# Altium schematic sheet Transceivers.SchDoc: Payload Card Transceivers
size A3; Revision: 1A; SheetNumber: 2; SheetTotal: 6; Organization: Brickworks; Address1: Matthew Glazer; Address2: Design Engineer
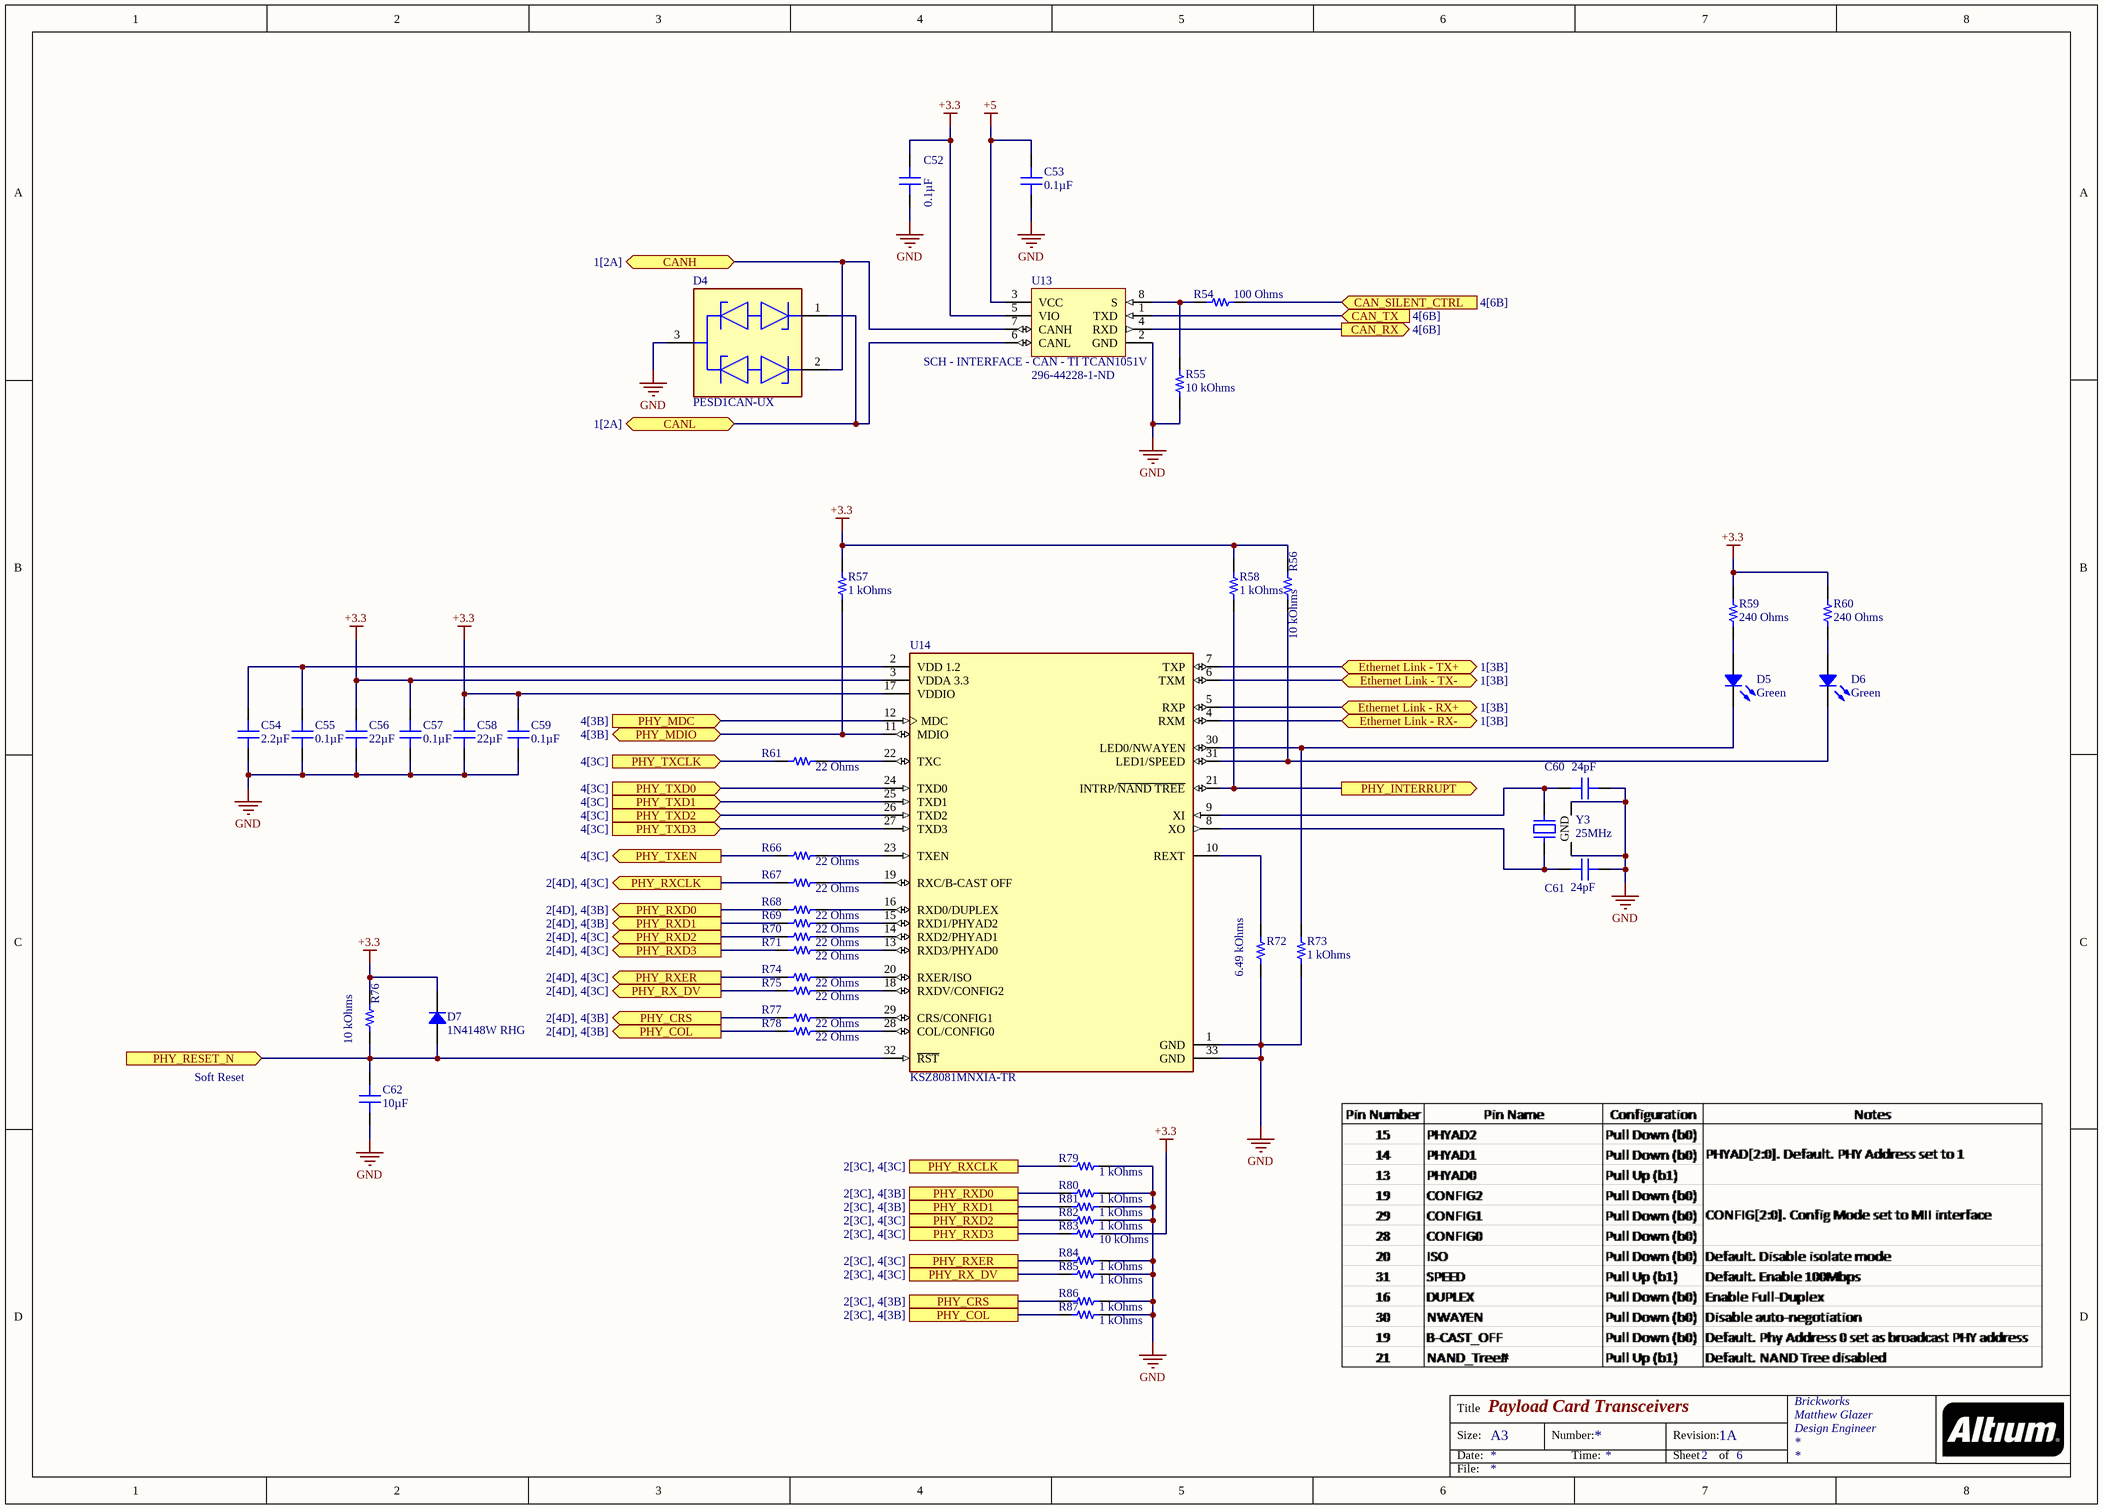
[diagram p0: Transceivers.SchDoc]

## Parts
C52  0.1µF  [CAP 0603_1608]
C53  0.1µF  [CAP 0603_1608]
C54  2.2µF  [CAP 0805_2012]
C55  0.1µF  [CAP 0603_1608]
C56  22µF  [CAP 0805_2012]
C57  0.1µF  [CAP 0603_1608]
C58  22µF  [CAP 0805_2012]
C59  0.1µF  [CAP 0603_1608]
C60  24pF  [CAP 0603_1608]
C61  24pF  [CAP 0603_1608]
C62  10µF  [CAP 0805_2012]
D4  PESD1CAN-UX  [FP-SOT323-MFG]
D5  Green  [LED 0603_1608 GREEN]
D6  Green  [LED 0603_1608 GREEN]
D7  1N4148W RHG  [SOD123F]
R54  100 Ohms  [RES 0603_1608]
R55  10 kOhms  [RES 0603_1608]
R56  10 kOhms  [RES 0603_1608]
R57  1 kOhms  [RES 0603_1608]
R58  1 kOhms  [RES 0603_1608]
R59  240 Ohms  [RES 0603_1608]
R60  240 Ohms  [RES 0603_1608]
R61  22 Ohms  [RES 0603_1608]
R66  22 Ohms  [RES 0603_1608]
R67  22 Ohms  [RES 0603_1608]
R68  22 Ohms  [RES 0603_1608]
R69  22 Ohms  [RES 0603_1608]
R70  22 Ohms  [RES 0603_1608]
R71  22 Ohms  [RES 0603_1608]
R72  6.49 kOhms  [RES 0603_1608]
R73  1 kOhms  [RES 0603_1608]
R74  22 Ohms  [RES 0603_1608]
R75  22 Ohms  [RES 0603_1608]
R76  10 kOhms  [RES 0603_1608]
R77  22 Ohms  [RES 0603_1608]
R78  22 Ohms  [RES 0603_1608]
R79  1 kOhms  [RES 0603_1608]
R80  1 kOhms  [RES 0603_1608]
R81  1 kOhms  [RES 0603_1608]
R82  1 kOhms  [RES 0603_1608]
R83  10 kOhms  [RES 0603_1608]
R84  1 kOhms  [RES 0603_1608]
R85  1 kOhms  [RES 0603_1608]
R86  1 kOhms  [RES 0603_1608]
R87  1 kOhms  [RES 0603_1608]
U13  SCH - INTERFACE - CAN - TI TCAN1051V  Supplier Part Number 1: 296-44228-1-ND  [PCB - LEADS - SOIC - TI SOIC-8]
U14  KSZ8081MNXIA-TR  [FP-QFN55-32LD-PL-5-MFG]
Y3  25MHz  [EPSON TSX-3225]

## Ports
CAN_RX (out, see 4[6B]), CAN_SILENT_CTRL (in, see 4[6B]), CAN_TX (in, see 4[6B]), CANH (bidir, see 1[2A]), CANL (bidir, see 1[2A]), Ethernet Link - RX+ (bidir, see 1[3B]), Ethernet Link - RX- (bidir, see 1[3B]), Ethernet Link - TX+ (bidir, see 1[3B]), Ethernet Link - TX- (bidir, see 1[3B]), PHY_COL (out, see 2[4D], 4[3B]), PHY_COL (see 2[3C], 4[3B]), PHY_CRS (out, see 2[4D], 4[3B]), PHY_CRS (see 2[3C], 4[3B]), PHY_INTERRUPT (out), PHY_MDC (in, see 4[3B]), PHY_MDIO (bidir, see 4[3B]), PHY_RESET_N (in), PHY_RX_DV (out, see 2[4D], 4[3C]), PHY_RX_DV (see 2[3C], 4[3C]), PHY_RXCLK (out, see 2[4D], 4[3C]), PHY_RXCLK (see 2[3C], 4[3C]), PHY_RXD0 (out, see 2[4D], 4[3B]), PHY_RXD0 (see 2[3C], 4[3B]), PHY_RXD1 (out, see 2[4D], 4[3B]), PHY_RXD1 (see 2[3C], 4[3B]), PHY_RXD2 (out, see 2[4D], 4[3C]), PHY_RXD2 (see 2[3C], 4[3C]), PHY_RXD3 (out, see 2[4D], 4[3C]), PHY_RXD3 (see 2[3C], 4[3C]), PHY_RXER (out, see 2[4D], 4[3C]), PHY_RXER (see 2[3C], 4[3C]), PHY_TXCLK (in, see 4[3C]), PHY_TXD0 (in, see 4[3C]), PHY_TXD1 (in, see 4[3C]), PHY_TXD2 (in, see 4[3C]), PHY_TXD3 (in, see 4[3C]), PHY_TXEN (out, see 4[3C])

## Nets
+3.3: C52.2 C56.2 C57.2 C58.2 C59.2 D7.2 R56.2 R57.2 R58.2 R59.2 R60.2 R76.2 R83.1 U13.5(VIO) U14.3(VDDA_3.3) U14.17(VDDIO)
+5: C53.2 U13.3(VCC)
GND: C52.1 C53.1 C54.1 C55.1 C56.1 C57.1 C58.1 C59.1 C60.2 C61.2 C62.1 D4.3(common_cathode) R55.1 R72.1 R73.1 R79.1 R80.1 R81.1 R82.1 R84.1 R85.1 R86.1 R87.1 U13.2(GND) U14.1(GND) U14.33(GND) Y3.2(GND) Y3.4(GND)
CAN_RX: U13.4(RXD) ; port CAN_RX
CAN_SILENT_CTRL: R54.2 ; port CAN_SILENT_CTRL
CAN_TX: U13.1(TXD) ; port CAN_TX
CANH: D4.2(cathode_2) U13.7(CANH) ; port CANH
CANL: D4.1(cathode_1) U13.6(CANL) ; port CANL
Ethernet Link - RX+: U14.5(RXP) ; port Ethernet Link - RX+
Ethernet Link - RX-: U14.4(RXM) ; port Ethernet Link - RX-
Ethernet Link - TX+: U14.7(TXP) ; port Ethernet Link - TX+
Ethernet Link - TX-: U14.6(TXM) ; port Ethernet Link - TX-
PHY_COL: R78.1 R87.2 ; port PHY_COL
PHY_CRS: R77.1 R86.2 ; port PHY_CRS
PHY_INTERRUPT: R58.1 U14.21(INTRP/~{NAND_TREE}) ; port PHY_INTERRUPT
PHY_MDC: U14.12(MDC) ; port PHY_MDC
PHY_MDIO: R57.1 U14.11(MDIO) ; port PHY_MDIO
PHY_RESET_N: C62.2 D7.1 R76.1 U14.32(~{RST}) ; port PHY_RESET_N
PHY_RX_DV: R75.1 R85.2 ; port PHY_RX_DV
PHY_RXCLK: R67.1 R79.2 ; port PHY_RXCLK
PHY_RXD0: R68.1 R80.2 ; port PHY_RXD0
PHY_RXD1: R69.1 R81.2 ; port PHY_RXD1
PHY_RXD2: R70.1 R82.2 ; port PHY_RXD2
PHY_RXD3: R71.1 R83.2 ; port PHY_RXD3
PHY_RXER: R74.1 R84.2 ; port PHY_RXER
PHY_TXCLK: R61.1 ; port PHY_TXCLK
PHY_TXD0: U14.24(TXD0) ; port PHY_TXD0
PHY_TXD1: U14.25(TXD1) ; port PHY_TXD1
PHY_TXD2: U14.26(TXD2) ; port PHY_TXD2
PHY_TXD3: U14.27(TXD3) ; port PHY_TXD3
PHY_TXEN: R66.1 ; port PHY_TXEN
NetC54_2: C54.2 C55.2 U14.2(VDD_1.2)
NetC60_1: C60.1 U14.9(XI) Y3.3
NetC61_1: C61.1 U14.8(XO) Y3.1
NetD5_1: D5.1 R59.1
NetD5_2: D5.2 R73.2 U14.30(LED0/NWAYEN)
NetD6_1: D6.1 R60.1
NetD6_2: D6.2 R56.1 U14.31(LED1/SPEED)
NetR54_1: R54.1 R55.2 U13.8(S)
NetR61_2: R61.2 U14.22(TXC)
NetR66_2: R66.2 U14.23(TXEN)
NetR67_2: R67.2 U14.19(RXC/B-CAST_OFF)
NetR68_2: R68.2 U14.16(RXD0/DUPLEX)
NetR69_2: R69.2 U14.15(RXD1/PHYAD2)
NetR70_2: R70.2 U14.14(RXD2/PHYAD1)
NetR71_2: R71.2 U14.13(RXD3/PHYAD0)
NetR72_2: R72.2 U14.10(REXT)
NetR74_2: R74.2 U14.20(RXER/ISO)
NetR75_2: R75.2 U14.18(RXDV/CONFIG2)
NetR77_2: R77.2 U14.29(CRS/CONFIG1)
NetR78_2: R78.2 U14.28(COL/CONFIG0)

## Notes on the sheet
- Soft Reset
- Title
- Size:
- Date:
- A3
- Number:
- Time:
- Revision:
- Sheet
- of
- File:

## Library data of the parts
C52 C53 C55 C57 C59 = CL10B104KA8WPNC: CAP CER 0.1UF 25V X7R 0603; Manufacturer: Samsung Electro-Mechanics; Tolerance: ±10%; Part Number: CL10B104KA8WPNC; Value: 0.1µF; Applications: Automotive; Capacitance: 0.1µF; ComponentLink1Description: Datasheet; ComponentLink1URL: http://www.samsungsem.com/kr/support/product-search/mlcc/CL10B104KA8WPNC.jsp; ComponentLink2Description: DigiKey Link; ComponentLink2URL: http://digikey.com/product-detail/en/samsung-electro-mechanics/CL10B104KA8WPNC/1276-6717-1-ND/5961576; Device Package: 0603 (1608 Metric); Features: Open Mode; LastUpdated: 9/2/2020 1:03:30 AM; Lifecycle Status: Active; Minimum Order: 1; Mounting Type: Surface Mount, MLCC; Operating Temperature: -55°C ~ 125°C; Package / Case: 0603 (1608 Metric); Packaging: TapeAndReel; PartId: 5631; Part Status: Active; Price: 0.02; Ratings: AEC-Q200; Series: CL; Size / Dimension: 0.063" L x 0.031" W (1.60mm x 0.80mm); Supplier 1: DigiKey; Supplier Part Number 1: 1276-6717-1-ND; Temperature Coefficient: X7R; Thickness (Max): 0.035" (0.90mm); Voltage - Rated: 25V
C54 = CL21A225KPFNNNE: CAP CER 2.2UF 10V X5R 0805; Manufacturer: Samsung Electro-Mechanics; Tolerance: ±10%; Part Number: CL21A225KPFNNNE; Value: 2.2µF; Applications: General Purpose; Capacitance: 2.2µF; ComponentLink1Description: Datasheet; ComponentLink1URL: http://www.samsungsem.com/kr/support/product-search/mlcc/CL21A225KPFNNNE.jsp; ComponentLink2Description: DigiKey Link; ComponentLink2URL: http://digikey.com/product-detail/en/samsung-electro-mechanics/CL21A225KPFNNNE/1276-2902-1-ND/3890988; Device Package: 0805 (2012 Metric); LastUpdated: 9/2/2020 1:04:25 AM; Lifecycle Status: Active; Minimum Order: 1; Mounting Type: Surface Mount, MLCC; Operating Temperature: -55°C ~ 85°C; Package / Case: 0805 (2012 Metric); Packaging: TapeAndReel; PartId: 11848; Part Status: Active; Price: 0.03; Series: CL; Size / Dimension: 0.079" L x 0.049" W (2.00mm x 1.25mm); Supplier 1: DigiKey; Supplier Part Number 1: 1276-2902-1-ND; Temperature Coefficient: X5R; Thickness (Max): 0.053" (1.35mm); Voltage - Rated: 10V
C56 C58 = CL21A226KPCLRNC: CAP CER 22UF 10V X5R 0805; Manufacturer: Samsung Electro-Mechanics; Tolerance: ±10%; Part Number: CL21A226KPCLRNC; Value: 22µF; Applications: General Purpose; Capacitance: 22µF; ComponentLink1Description: Datasheet; ComponentLink1URL: http://www.samsungsem.com/kr/support/product-search/mlcc/CL21A226KPCLRNC.jsp; ComponentLink2Description: DigiKey Link; ComponentLink2URL: http://digikey.com/product-detail/en/samsung-electro-mechanics/CL21A226KPCLRNC/1276-6786-1-ND/5961645; Device Package: 0805 (2012 Metric); Features: Low Profile; LastUpdated: 9/2/2020 1:04:38 AM; Lifecycle Status: Active; Minimum Order: 1; Mounting Type: Surface Mount, MLCC; Operating Temperature: -55°C ~ 85°C; Package / Case: 0805 (2012 Metric); Packaging: TapeAndReel; PartId: 4833; Part Status: Active; Price: 0.08; Series: CL; Size / Dimension: 0.079" L x 0.049" W (2.00mm x 1.25mm); Supplier 1: DigiKey; Supplier Part Number 1: 1276-6786-1-ND; Temperature Coefficient: X5R; Thickness (Max): 0.037" (0.95mm); Voltage - Rated: 10V
C60 C61 = CL10C240JB8NNNC: CAP CER 24PF 50V C0G/NP0 0603; Manufacturer: Samsung Electro-Mechanics; Temperature Coefficient: C0G, NP0; Tolerance: ±5%; Part Number: CL10C240JB8NNNC; Value: 24pF; Applications: General Purpose; Capacitance: 24pF; ComponentLink1Description: Datasheet; ComponentLink1URL: http://www.samsungsem.com/kr/support/product-search/mlcc/CL10C240JB8NNNC.jsp; ComponentLink2Description: DigiKey Link; ComponentLink2URL: http://digikey.com/product-detail/en/samsung-electro-mechanics/CL10C240JB8NNNC/1276-1761-1-ND/3889847; Device Package: 0603 (1608 Metric); LastUpdated: 9/2/2020 1:03:22 AM; Lifecycle Status: Active; Minimum Order: 1; Mounting Type: Surface Mount, MLCC; Operating Temperature: -55°C ~ 125°C; Package / Case: 0603 (1608 Metric); Packaging: TapeAndReel; PartId: 10003; Part Status: Active; Price: 0.01; Series: CL; Size / Dimension: 0.063" L x 0.031" W (1.60mm x 0.80mm); Supplier 1: DigiKey; Supplier Part Number 1: 1276-1761-1-ND; Thickness (Max): 0.035" (0.90mm); Voltage - Rated: 50V
C62 = CC0805KKX5R7BB106: CAP CER 10UF 16V X5R 0805; Manufacturer: Yageo; Tolerance: ±10%; Part Number: CC0805KKX5R7BB106; Value: 10µF; Applications: General Purpose; Capacitance: 10µF; ComponentLink1Description: Datasheet; ComponentLink1URL: https://www.yageo.com/upload/media/product/productsearch/datasheet/mlcc/UPY-GPHC_X5R_4V-to-50V_25.pdf; ComponentLink2Description: DigiKey Link; ComponentLink2URL: http://digikey.com/product-detail/en/yageo/CC0805KKX5R7BB106/311-1865-1-ND/5195767; Device Package: 0805 (2012 Metric); LastUpdated: 9/2/2020 1:04:30 AM; Lifecycle Status: Active; Minimum Order: 1; Mounting Type: Surface Mount, MLCC; Operating Temperature: -55°C ~ 85°C; Package / Case: 0805 (2012 Metric); Packaging: TapeAndReel; PartId: 8867; Part Status: Active; Price: 0.09; Series: CC; Size / Dimension: 0.079" L x 0.049" W (2.00mm x 1.25mm); Supplier 1: DigiKey; Supplier Part Number 1: 311-1865-1-ND; Temperature Coefficient: X5R; Thickness (Max): 0.057" (1.45mm); Voltage - Rated: 16V
D4 = CMP-14436-000006-1: TVS DIODE 24V 50V SC70-3
D5 D6 = LTST-C193KGKT-5A: LED GREEN CLEAR CHIP SMD; Manufacturer: Lite-On Inc.; Configuration: Standard; Current - Test: 5mA; Lens Color: Colorless; Lens Size: 1.15mm x 0.80mm; Lens Style: Rectangle with Flat Top; Millicandela Rating: 16.25mcd; Viewing Angle: 130°; Voltage - Forward (Vf) (Typ): 2V; Wavelength - Dominant: 572nm; Wavelength - Peak: 574nm; Part Number: LTST-C193KGKT-5A; Color: Green; ComponentLink1Description: Datasheet; ComponentLink1URL: http://optoelectronics.liteon.com/upload/download/DS22-2007-0094/LTST-C193KGKT-5A.PDF; ComponentLink2Description: DigiKey Link; ComponentLink2URL: http://digikey.com/product-detail/en/lite-on-inc/LTST-C193KGKT-5A/160-1828-1-ND/2356247; Device Package: 0603 (1608 Metric); Height (Max): 0.45mm; LastUpdated: 9/2/2020 1:20:41 AM; Lens Transparency: Clear; Lifecycle Status: Active; Minimum Order: 1; Mounting Type: Surface Mount; Package / Case: 0603 (1608 Metric); Packaging: TapeAndReel; PartId: 694; Part Status: Active; Price: 0.06; Series: -; Size / Dimension: 1.60mm L x 0.80mm W; Supplier 1: DigiKey; Supplier Part Number 1: 160-1828-1-ND; Supplier Device Package: Chip LED; Value: Green
D7 = 1N4148W RHG: DIODE GEN PURP 100V 150MA SOD123; Manufacturer: Taiwan Semiconductor Corporation; Current - Average Rectified (Io): 150mA (DC); Current - Reverse Leakage @ Vr: 5µA @ 75V; Diode Type: Standard; Reverse Recovery Time (trr): 4ns; Speed: Fast Recovery =< 500ns, > 200mA (Io); Voltage - Forward (Vf) (Max) @ If: 1V @ 100mA; Part Number: 1N4148W RHG; ComponentLink1Description: Datasheet; ComponentLink1URL: https://www.taiwansemi.com/products/datasheet/1N4148W%20SERIES_K1804.pdf; ComponentLink2Description: DigiKey Link; ComponentLink2URL: http://digikey.com/product-detail/en/taiwan-semiconductor-corporation/1N4148W-RHG/1N4148WRHGCT-ND/7357066; LastUpdated: 9/2/2020 1:19:10 AM; Lifecycle Status: Active; Minimum Order: 1; Mounting Type: Surface Mount; Operating Temperature - Junction: -65°C ~ 150°C; Package / Case: SOD-123F; Packaging: TapeAndReel; PartId: 1073; Part Status: Active; Price: 0.03; Series: -; Supplier 1: DigiKey; Supplier Part Number 1: 1N4148WRHGCT-ND; Supplier Device Package: SOD-123F; Voltage - DC Reverse (Vr) (Max): 100V
R54 = RMCF0603FG100R: RES 100 OHM 1% 1/10W 0603; Manufacturer: Stackpole Electronics Inc; Power (Watts): 0.1W, 1/10W; Temperature Coefficient: ±100ppm/°C; Part Number: RMCF0603FG100R; Value: 100 Ohms; ComponentLink1Description: Datasheet; ComponentLink1URL: https://www.seielect.com/catalog/sei-rmcf_rmcp.pdf; ComponentLink2Description: DigiKey Link; ComponentLink2URL: http://digikey.com/product-detail/en/stackpole-electronics-inc/RMCF0603FG100R/RMCF0603FG100RCT-ND/4425033; Composition: Thick Film; Device Package: 0603 (1608 Metric); Features: Automotive AEC-Q200; Height - Seated (Max): 0.022" (0.55mm); LastUpdated: 9/2/2020 1:09:39 AM; Lifecycle Status: Active; Minimum Order: 1; Number of Terminations: 2; Operating Temperature: -55°C ~ 155°C; Package / Case: 0603 (1608 Metric); Packaging: CutTape; PartId: 24036; Part Status: Active; Price: 0.10; Ratings: AEC-Q200; Resistance: 100 Ohms; Series: RMCF; Size / Dimension: 0.061" L x 0.031" W (1.55mm x 0.80mm); Supplier 1: DigiKey; Supplier Part Number 1: RMCF0603FG100RCT-ND; Supplier Device Package: 0603; Tolerance: ±1%
R55 R56 R76 R83 = RMCF0603JT10K0: RES 10K OHM 5% 1/10W 0603; Manufacturer: Stackpole Electronics Inc; Power (Watts): 0.1W, 1/10W; Temperature Coefficient: ±200ppm/°C; Part Number: RMCF0603JT10K0; Value: 10 kOhms; ComponentLink1Description: Datasheet; ComponentLink1URL: https://www.seielect.com/catalog/sei-packaging.pdf; ComponentLink2Description: DigiKey Link; ComponentLink2URL: http://digikey.com/product-detail/en/stackpole-electronics-inc/RMCF0603JT10K0/RMCF0603JT10K0CT-ND/1943191; Composition: Thick Film; Device Package: 0603 (1608 Metric); Features: Automotive AEC-Q200; Height - Seated (Max): 0.022" (0.55mm); LastUpdated: 8/30/2020 8:48:45 PM; Lifecycle Status: Active; Minimum Order: 1; Number of Terminations: 2; Operating Temperature: -55°C ~ 155°C; Package / Case: 0603 (1608 Metric); Packaging: CutTape; PartId: 25659; Part Status: Active; Price: 0.10; Ratings: AEC-Q200; Resistance: 10 kOhms; Series: RMCF; Size / Dimension: 0.061" L x 0.031" W (1.55mm x 0.80mm); Supplier 1: DigiKey; Supplier Part Number 1: RMCF0603JT10K0CT-ND; Supplier Device Package: 0603; Tolerance: ±5%
R57 R58 R73 R79-R82 R84-R87 = RNCP0603FTD1K00: RES 1K OHM 1% 1/8W 0603; Manufacturer: Stackpole Electronics Inc; Power (Watts): 0.125W, 1/8W; Temperature Coefficient: ±100ppm/°C; Part Number: RNCP0603FTD1K00; Value: 1 kOhms; ComponentLink1Description: Datasheet; ComponentLink1URL: https://www.seielect.com/catalog/sei-rncp.pdf; ComponentLink2Description: DigiKey Link; ComponentLink2URL: http://digikey.com/product-detail/en/stackpole-electronics-inc/RNCP0603FTD1K00/RNCP0603FTD1K00CT-ND/2240445; Composition: Thin Film; Device Package: 0603 (1608 Metric); Features: Anti-Sulfur, Moisture Resistant; Height - Seated (Max): 0.020" (0.50mm); LastUpdated: 9/2/2020 1:10:23 AM; Lifecycle Status: Active; Minimum Order: 1; Number of Terminations: 2; Operating Temperature: -55°C ~ 155°C; Package / Case: 0603 (1608 Metric); Packaging: TapeAndReel; PartId: 5694; Part Status: Active; Price: 0.01; Resistance: 1 kOhms; Series: RNCP; Size / Dimension: 0.059" L x 0.031" W (1.50mm x 0.80mm); Supplier 1: DigiKey; Supplier Part Number 1: RNCP0603FTD1K00CT-ND; Supplier Device Package: 0603; Tolerance: ±1%
R59 R60 = RMCF0603JT240R: RES 240 OHM 5% 1/10W 0603; Manufacturer: Stackpole Electronics Inc; Power (Watts): 0.1W, 1/10W; Temperature Coefficient: ±200ppm/°C; Part Number: RMCF0603JT240R; Value: 240 Ohms; ComponentLink1Description: Datasheet; ComponentLink1URL: https://www.seielect.com/catalog/sei-rmcf_rmcp.pdf; ComponentLink2Description: DigiKey Link; ComponentLink2URL: http://digikey.com/product-detail/en/stackpole-electronics-inc/RMCF0603JT240R/RMCF0603JT240RCT-ND/2418189; Composition: Thick Film; Device Package: 0603 (1608 Metric); Features: Automotive AEC-Q200; Height - Seated (Max): 0.022" (0.55mm); LastUpdated: 9/2/2020 1:10:22 AM; Lifecycle Status: Active; Minimum Order: 1; Number of Terminations: 2; Operating Temperature: -55°C ~ 155°C; Package / Case: 0603 (1608 Metric); Packaging: CutTape; PartId: 5995; Part Status: Active; Price: 0.10; Ratings: AEC-Q200; Resistance: 240 Ohms; Series: RMCF; Size / Dimension: 0.061" L x 0.031" W (1.55mm x 0.80mm); Supplier 1: DigiKey; Supplier Part Number 1: RMCF0603JT240RCT-ND; Supplier Device Package: 0603; Tolerance: ±5%
R61 R66-R71 R74 R75 R77 R78 = RMCF0603FT22R0: RES 22 OHM 1% 1/10W 0603; Manufacturer: Stackpole Electronics Inc; Power (Watts): 0.1W, 1/10W; Temperature Coefficient: ±100ppm/°C; Part Number: RMCF0603FT22R0; Value: 22 Ohms; ComponentLink1Description: Datasheet; ComponentLink1URL: https://www.seielect.com/catalog/sei-packaging.pdf; ComponentLink2Description: DigiKey Link; ComponentLink2URL: http://digikey.com/product-detail/en/stackpole-electronics-inc/RMCF0603FT22R0/RMCF0603FT22R0CT-ND/1942946; Composition: Thick Film; Device Package: 0603 (1608 Metric); Features: Automotive AEC-Q200; Height - Seated (Max): 0.022" (0.55mm); LastUpdated: 9/2/2020 1:10:13 AM; Lifecycle Status: Active; Minimum Order: 1; Number of Terminations: 2; Operating Temperature: -55°C ~ 155°C; Package / Case: 0603 (1608 Metric); Packaging: CutTape; PartId: 10611; Part Status: Active; Price: 0.10; Ratings: AEC-Q200; Resistance: 22 Ohms; Series: RMCF; Size / Dimension: 0.061" L x 0.031" W (1.55mm x 0.80mm); Supplier 1: DigiKey; Supplier Part Number 1: RMCF0603FT22R0CT-ND; Supplier Device Package: 0603; Tolerance: ±1%
R72 = RNCP0603FTD6K49: RES 6.49K OHM 1% 1/8W 0603; Manufacturer: Stackpole Electronics Inc; Power (Watts): 0.125W, 1/8W; Temperature Coefficient: ±100ppm/°C; Part Number: RNCP0603FTD6K49; Value: 6.49 kOhms; ComponentLink1Description: Datasheet; ComponentLink1URL: https://www.seielect.com/catalog/sei-rncp.pdf; ComponentLink2Description: DigiKey Link; ComponentLink2URL: http://digikey.com/product-detail/en/stackpole-electronics-inc/RNCP0603FTD6K49/RNCP0603FTD6K49CT-ND/2240472; Composition: Thin Film; Device Package: 0603 (1608 Metric); Features: Anti-Sulfur, Moisture Resistant; Height - Seated (Max): 0.020" (0.50mm); LastUpdated: 9/2/2020 1:09:47 AM; Lifecycle Status: Active; Minimum Order: 1; Number of Terminations: 2; Operating Temperature: -55°C ~ 155°C; Package / Case: 0603 (1608 Metric); Packaging: TapeAndReel; PartId: 22308; Part Status: Active; Price: 0.01; Resistance: 6.49 kOhms; Series: RNCP; Size / Dimension: 0.059" L x 0.031" W (1.50mm x 0.80mm); Supplier 1: DigiKey; Supplier Part Number 1: RNCP0603FTD6K49CT-ND; Supplier Device Package: 0603; Tolerance: ±1%
U14 = CMP-06281-000005-1: IC TRANSCEIVER FULL 1/1 32QFN; Manufacturer: Microchip; Max Junction Temp: +125°C; Max Supply Voltage: 3.465V; Min Supply Voltage: 1.71V; Data Rate: 100Mbits/s; Simplex Duplex: Full Duplex; Standoff Height: 0mm; Number Of Channels: 1; Interface: Ethernet,Other; Device Class L2: Interface ICs; Package: QFN55-32LD-PL-5; Octopart: https://octopart.com/ksz8081mnxia-tr-microchip-66799958; Ambient Temperature Range High: +85°C; Device Class L3: Ethernet Interface ICs; Mouser Description: Ethernet ICs 10/100 PHY,  0.11u, I-Temp; Temperature: -40°C to +85°C; Category: IC; Lead Free: Yes; Ambient Temperature Range Low: -40°C; Height: 1mm; ComponentLink2URL: http://ww1.microchip.com/downloads/en/DeviceDoc/00002202C.pdf; Digikey Description: IC TRANSCEIVER FULL 1/1 32QFN; Automotive: No; Device Class L1: Integrated Circuits (ICs); ComponentLink2Description: Datasheet; Temperature Range High: +85°C; Temperature Range Low: -40°C; RoHS: TRUE; Manufacturer Part Number: KSZ8081MNXIA-TR
Y3 = TSX-3225 25.0000MF20P-C0: CRYSTAL 25.0000MHZ 18PF SMD; Manufacturer: EPSON; ESR (Equivalent Series Resistance): 40 Ohms; Frequency Stability: ±20ppm; Frequency Tolerance: ±10ppm; Operating Mode: Fundamental; Part Number: TSX-3225 25.0000MF20P-C0; ComponentLink1Description: Datasheet; ComponentLink1URL: https://support.epson.biz/td/api/doc_check.php?dl=brief_TSX-3225&lang=en; ComponentLink2Description: DigiKey Link; ComponentLink2URL: http://digikey.com/product-detail/en/epson/TSX-3225-25.0000MF20P-C0/SER4212CT-ND/7430967; Frequency: 25MHz; Height - Seated (Max): 0.024" (0.60mm); LastUpdated: 9/2/2020 1:21:54 AM; Lifecycle Status: Active; Load Capacitance: 18pF; Minimum Order: 1; Mounting Type: Surface Mount; Operating Temperature: -20°C ~ 85°C; Package / Case: 4-SMD, No Lead; Packaging: TapeAndReel; PartId: 447; Part Status: Active; Price: 0.18; Series: TSX-3225; Size / Dimension: 0.126" L x 0.098" W (3.20mm x 2.50mm); Supplier 1: DigiKey; Supplier Part Number 1: SER4212CT-ND; Type: MHz Crystal; Value: 25MHz
U13 = SCH - INTERFACE - CAN - TI TCAN1051V: Supplier 1: Digi-Key